# EAGLE schematic TinyCam (EAGLE 7.7.0)
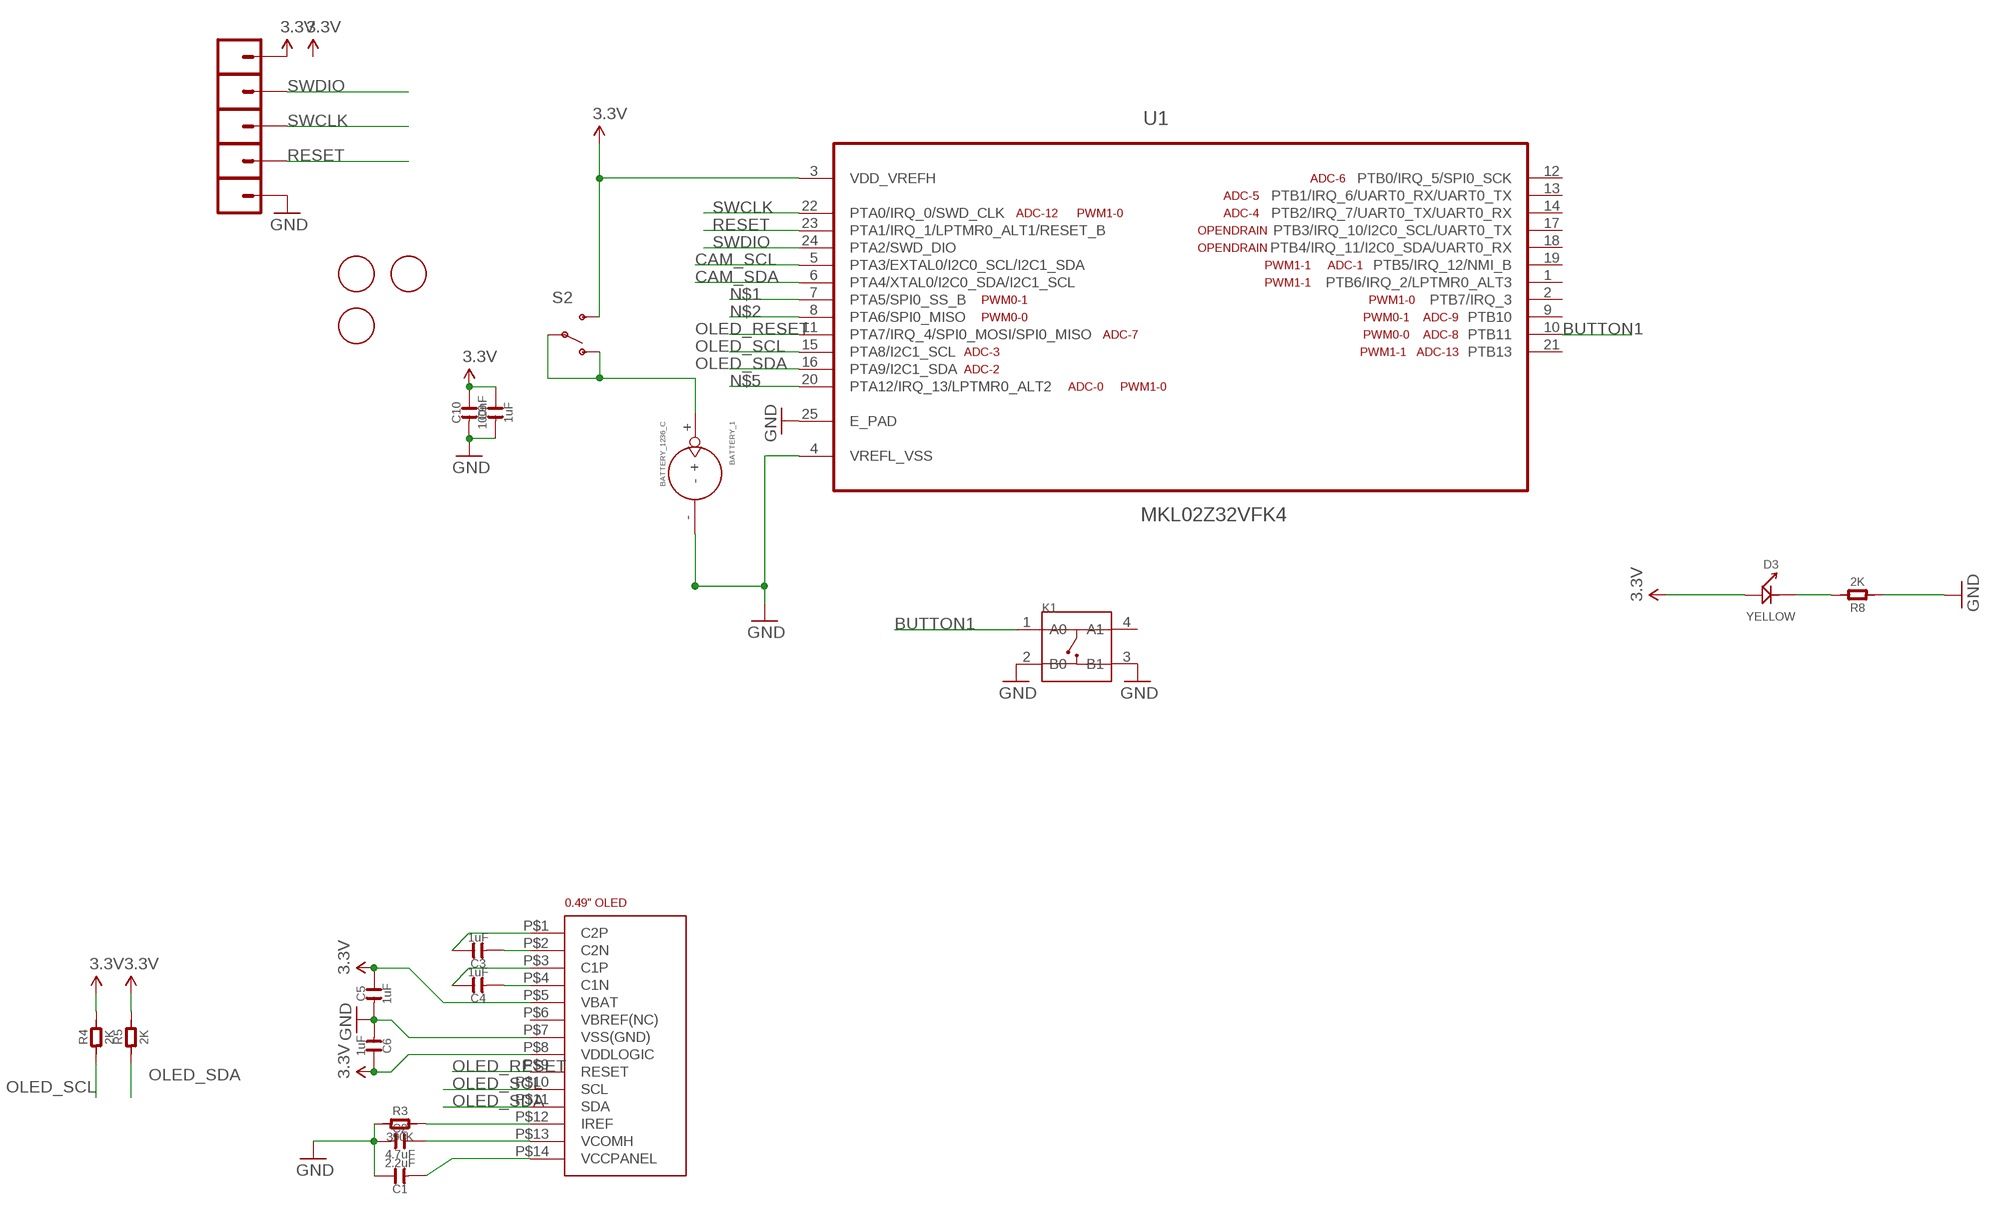
[diagram p0: schematic, sheet 1]

## Parts
BATTERY_1  BATTERY_1236_C  [BATTERY_1236_C]
C1  2.2uF  C-0603  [C0603]
C2  4.7uF  C-0603  [C0603]
C3  1uF  C-0603  [C0603]
C4  1uF  C-0603  [C0603]
C5  1uF  C-0603  [C0603]
C6  1uF  C-0603  [C0603]
C9  1uF  C-0603  [C0603]
C10  100nF  C-0603  [C0603]
D3  YELLOW  LED  [LED0603]
K1  BUTTON-4P-3100010P1  [4P-SMD-6.0X6.0X5.0H]
PTA6_MISO1  M01SMD-4.5X1.5  [PAD-1.5X4.5]
PTA6_MISO2  M01SMD-4.5X1.5  [PAD-1.5X4.5]
PTA6_MISO3  M01SMD-4.5X1.5  [PAD-1.5X4.5]
PTA6_MISO4  M01SMD-4.5X1.5  [PAD-1.5X4.5]
PTA6_MISO5  M01SMD-4.5X1.5  [PAD-1.5X4.5]
R3  390K  R-0603  [R0603]
R4  2K  R-0603  [R0603]
R5  2K  R-0603  [R0603]
R8  2K  R-0603  [R0603]
S2  SWITCH-SPDT-SMD-A  [SWITCH-SPST-SMD-A]
U1  MKL02Z32VFK4  [QFN50P400X400X100-25N]
U$1  0.49"OLEDFOLDED  [0.49"-FPC-0.7-14-FOLDED]
U$2  FIDUCIAL  [FIDUCIAL_1MM]
U$3  FIDUCIAL  [FIDUCIAL_1MM]
U$4  FIDUCIAL  [FIDUCIAL_1MM]

## Nets
3.3V: C5.2 C6.2 C9.2 C10.2 D3.+ PTA6_MISO1.P$1 R4.2 R5.2 S2.3(S) U1.3(VDD_VREFH) U$1.P$5(VBAT) U$1.P$8(VDDLOGIC)
BUTTON1: K1.1(A0) U1.10(PTB11)
CAM_SCL: U1.5(PTA3/EXTAL0/I2C0_SCL/I2C1_SDA)
CAM_SDA: U1.6(PTA4/XTAL0/I2C0_SDA/I2C1_SCL)
GND [GND]: BATTERY_1.- C1.2 C2.1 C5.1 C6.1 C9.1 C10.1 K1.2(B0) K1.3(B1) PTA6_MISO5.P$1 R3.1 R8.1 U1.4(VREFL_VSS) U1.25(E_PAD) U$1.P$7(VSS(GND))
N$1: U1.7(PTA5/SPI0_SS_B)
N$2: U1.8(PTA6/SPI0_MISO)
N$3: C3.2 U$1.P$1(C2P)
N$4: C4.2 U$1.P$3(C1P)
N$5: U1.20(PTA12/IRQ_13/LPTMR0_ALT2)
N$9: R3.2 U$1.P$12(IREF)
N$10: C1.1 U$1.P$14(VCCPANEL)
N$11: C2.2 U$1.P$13(VCOMH)
N$12: C3.1 U$1.P$2(C2N)
N$13: C4.1 U$1.P$4(C1N)
N$19: D3.- R8.2
OLED_RESET: U1.11(PTA7/IRQ_4/SPI0_MOSI/SPI0_MISO) U$1.P$9(RESET)
OLED_SCL: R4.1 U1.15(PTA8/I2C1_SCL) U$1.P$10(SCL)
OLED_SDA: R5.1 U1.16(PTA9/I2C1_SDA) U$1.P$11(SDA)
RESET: PTA6_MISO4.P$1 U1.23(PTA1/IRQ_1/LPTMR0_ALT1/RESET_B)
SWCLK: PTA6_MISO3.P$1 U1.22(PTA0/IRQ_0/SWD_CLK)
SWDIO: PTA6_MISO2.P$1 U1.24(PTA2/SWD_DIO)
VBAT: BATTERY_1.+ S2.1(O) S2.2(P)
Unconnected: K1.4(A1) U1.1(PTB6/IRQ_2/LPTMR0_ALT3) U1.2(PTB7/IRQ_3) U1.9(PTB10) U1.12(PTB0/IRQ_5/SPI0_SCK) U1.13(PTB1/IRQ_6/UART0_RX/UART0_TX) U1.14(PTB2/IRQ_7/UART0_TX/UART0_RX) U1.17(PTB3/IRQ_10/I2C0_SCL/UART0_TX) U1.18(PTB4/IRQ_11/I2C0_SDA/UART0_RX) U1.19(PTB5/IRQ_12/NMI_B) U1.21(PTB13) U$1.P$6(VBREF(NC))

## Library data of the parts
BATTERY_1 = MicroGameboyParts:BATTERY_1236_C: SOC004
C1-C6 C9 C10 = OPL:C*
D3 = OPL:LED*: LED
K1 = zephod-components:BUTTON-4P
PTA6_MISO1-PTA6_MISO5 = SparkFun-Connectors:M01: Header 1 Standard 1-pin 0.1" header. Use with straight break away headers (SKU : PRT-00116), right angle break away headers (PRT-00553), swiss pins (PRT-00743), machine pins (PRT-00117), and female headers (PRT-00115).
R3-R5 R8 = OPL:R*
S2 = SparkFun-Electromechanical:SWITCH-SPDT: SPDT Switch Simple slide switch, Spark Fun Electronics SKU : COM-00102 DPDT SMT slide switch, AYZ0202, SWCH-08179
U1 = FarnellThings:MKL02Z32VFK4: IC, MCU, 32BIT, CORTEX M0+, 48MHZ, QFN-24; MPN: MKL02Z32VFK4; OC_FARNELL: 2321481; OC_NEWARK: 61W9887; PACKAGE: QFN-24; SUPPLIER: FREESCALE SEMICONDUCTOR
U$1 = zephod-tft:0.49"OLED
U$2-U$4 = adafruit:FIDUCIAL: For use by pick and place machines to calibrate the vision/machine, 1mm By microbuilder.eu

## Net classes
0 default: clearance 0.178 mm
1 GND: width 0.203 mm, drill 0.203 mm, clearance 0.203 mm